# EAGLE design PCB-CMB-2b (EAGLE 6.4)

## Sheet 1 of 2
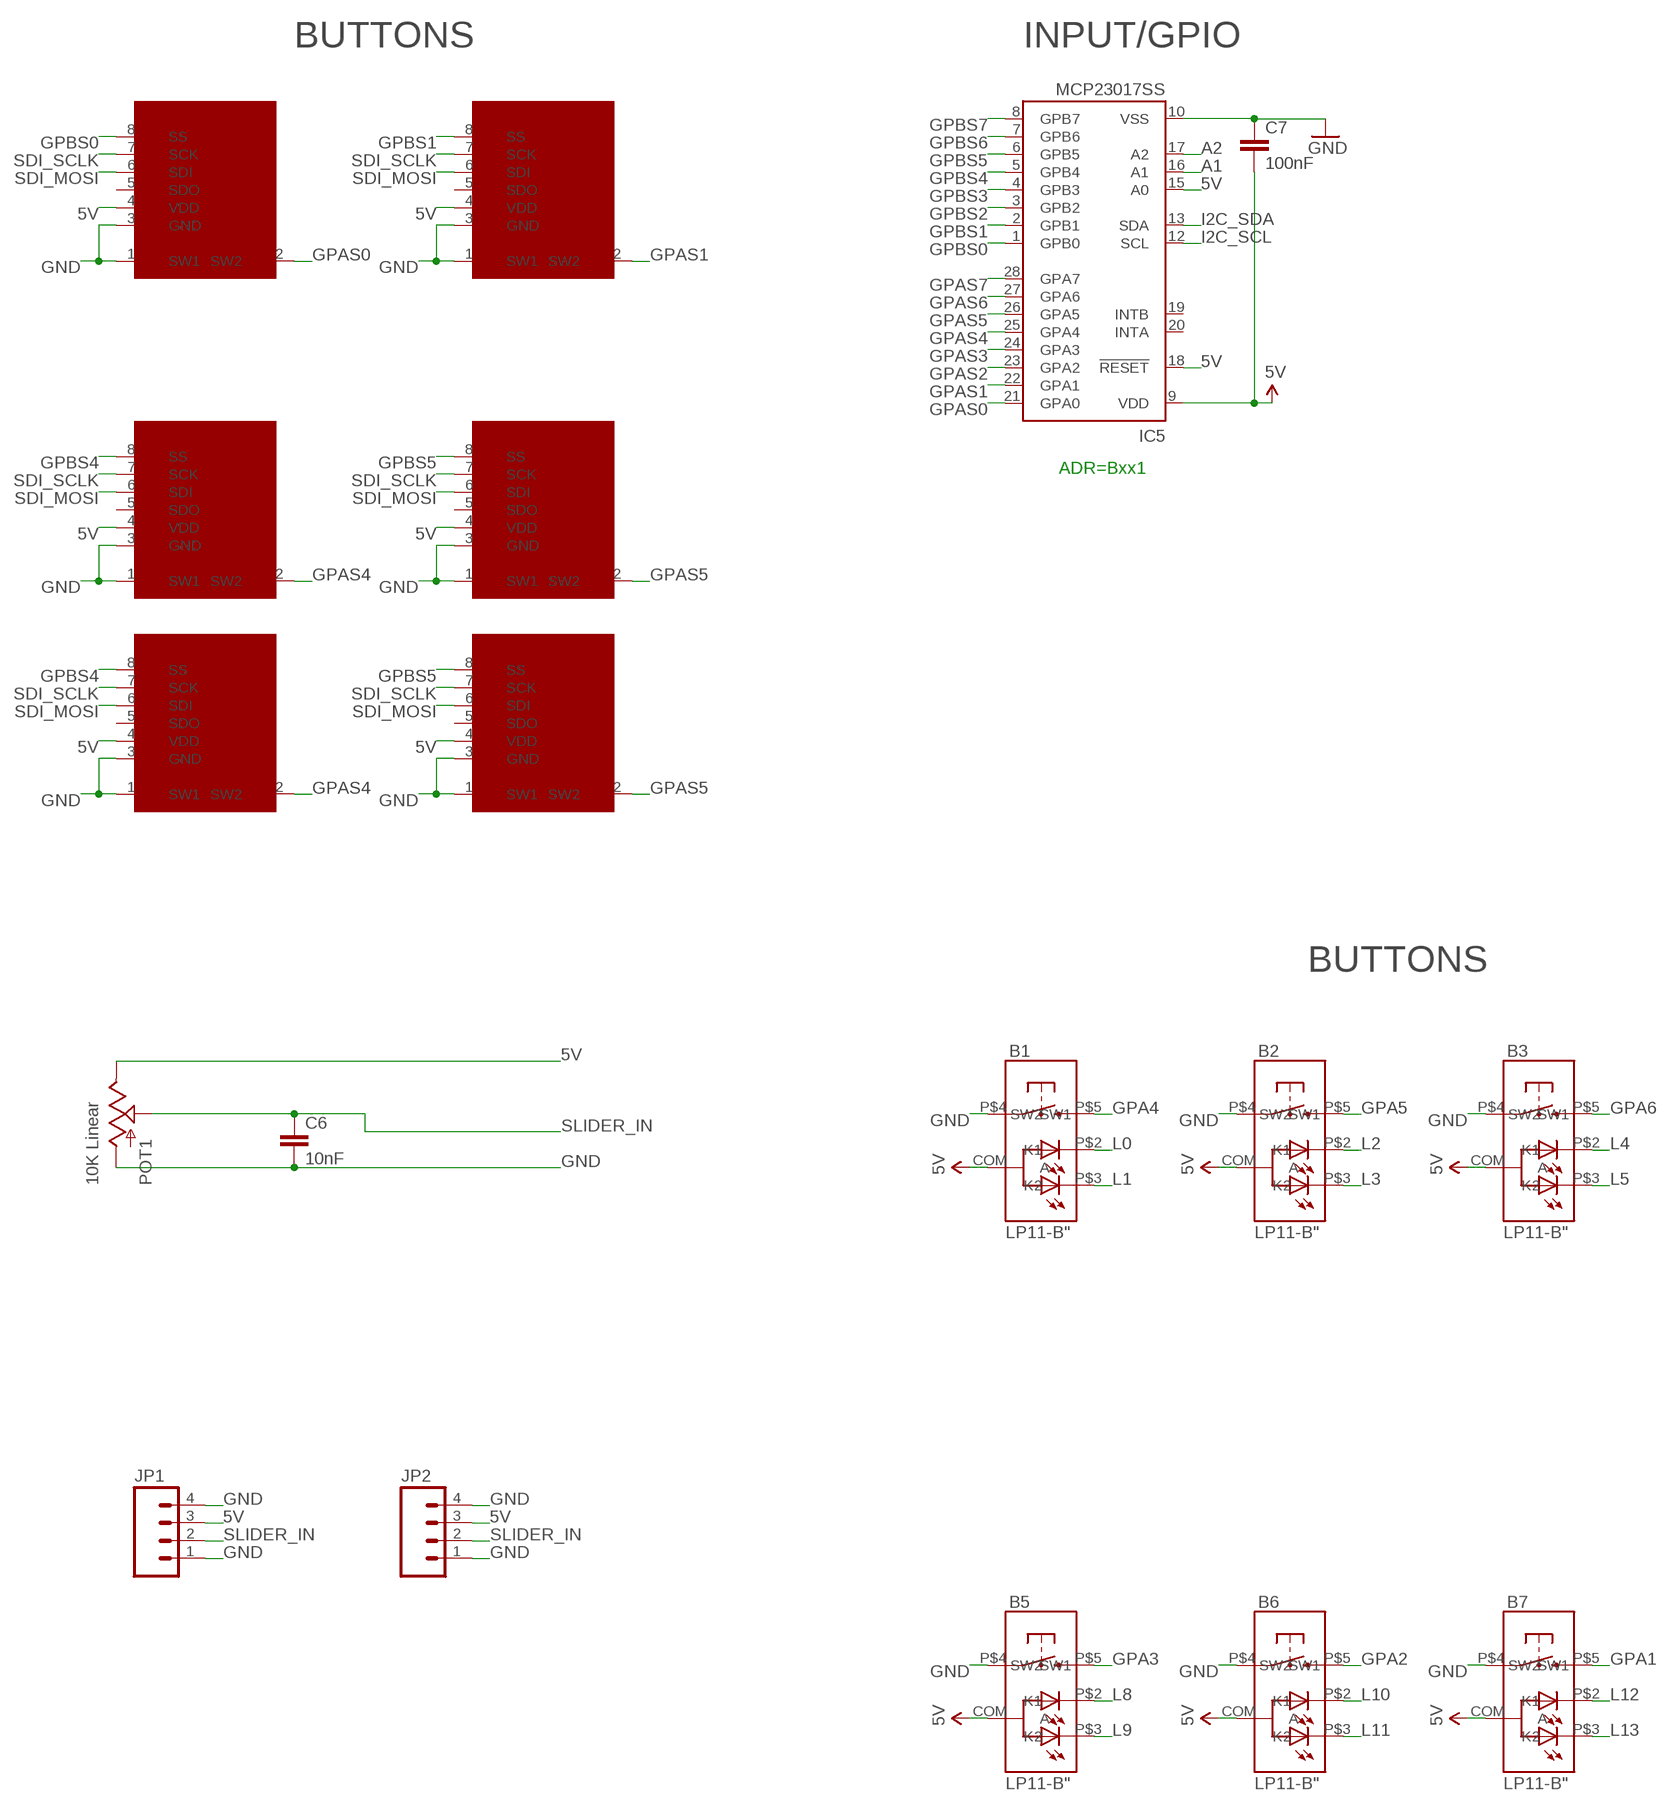
[diagram p0: schematic, sheet 1, part 1 of 2]
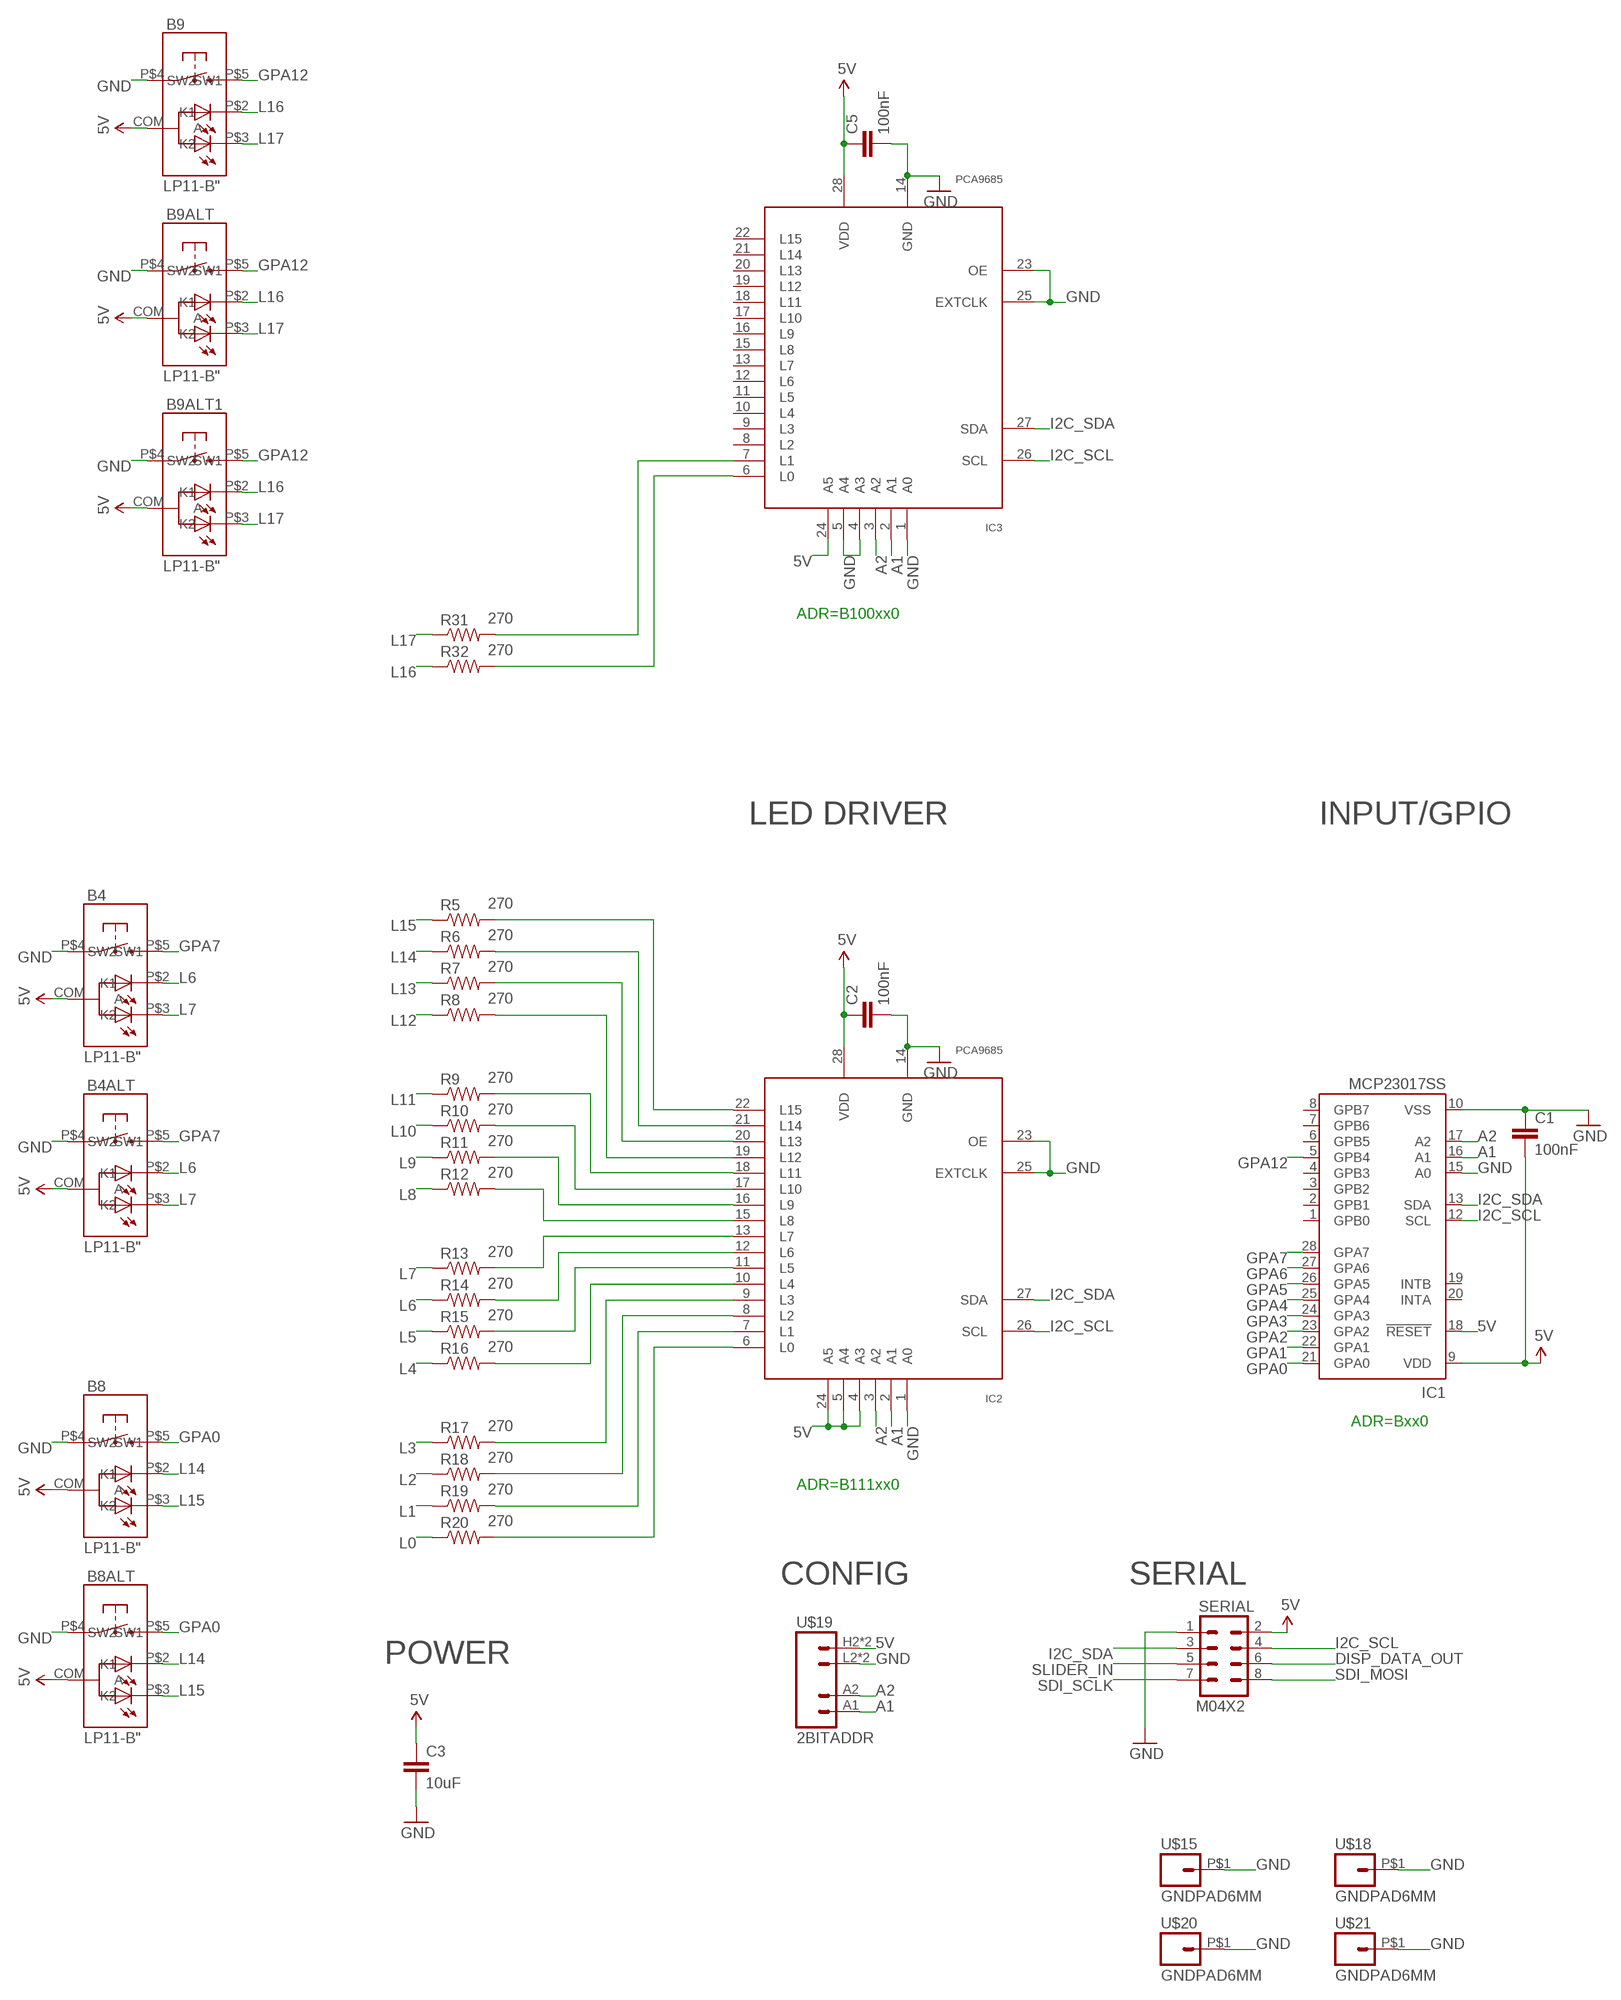
[diagram p1: schematic, sheet 1, part 2 of 2]

### Parts
B1  LP11-B"  [LP11]
B2  LP11-B"  [LP11]
B3  LP11-B"  [LP11]
B4  LP11-B"  [LP11]
B4ALT  LP11-B"  [LP11]
B5  LP11-B"  [LP11]
B6  LP11-B"  [LP11]
B7  LP11-B"  [LP11]
B8  LP11-B"  [LP11]
B8ALT  LP11-B"  [LP11]
B9  LP11-B"  [LP11]
B9ALT  LP11-B"  [LP11]
B9ALT1  LP11-B"  [LP11]
C1  100nF  CAP0603-CAP  [0603-CAP]
C2  100nF  CAP0603-CAP  [0603-CAP]
C3  10uF  CAP0805  [0805]
C5  100nF  CAP0603-CAP  [0603-CAP]
C6  10nF  CAP0603-CAP  [0603-CAP]
C7  100nF  CAP0603-CAP  [0603-CAP]
IC1  MCP23017SS  [SSOP28]
IC2  PCA9685  [TSSOP28]
IC3  PCA9685  [TSSOP28]
IC5  MCP23017SS  [SSOP28]
JP1  M04PTH  [1X04]
JP2  M04PTH  [1X04]
POT1  10K Linear  SLIDER20  [SLIDER20]
R5  270  RESISTOR0603-RES  [0603-RES]
R6  270  RESISTOR0603-RES  [0603-RES]
R7  270  RESISTOR0603-RES  [0603-RES]
R8  270  RESISTOR0603-RES  [0603-RES]
R9  270  RESISTOR0603-RES  [0603-RES]
R10  270  RESISTOR0603-RES  [0603-RES]
R11  270  RESISTOR0603-RES  [0603-RES]
R12  270  RESISTOR0603-RES  [0603-RES]
R13  270  RESISTOR0603-RES  [0603-RES]
R14  270  RESISTOR0603-RES  [0603-RES]
R15  270  RESISTOR0603-RES  [0603-RES]
R16  270  RESISTOR0603-RES  [0603-RES]
R17  270  RESISTOR0603-RES  [0603-RES]
R18  270  RESISTOR0603-RES  [0603-RES]
R19  270  RESISTOR0603-RES  [0603-RES]
R20  270  RESISTOR0603-RES  [0603-RES]
R31  270  RESISTOR0603-RES  [0603-RES]
R32  270  RESISTOR0603-RES  [0603-RES]
SERIAL  M04X2  [2X4]
SSW1  SMART_SWITCHSMART_SWITCH_8PIN  [SMART_SWITCH]
SSW2  SMART_SWITCHSMART_SWITCH_8PIN  [SMART_SWITCH]
SSW5  SMART_SWITCHSMART_SWITCH_8PIN  [SMART_SWITCH]
SSW5ALT  SMART_SWITCHSMART_SWITCH_8PIN  [SMART_SWITCH]
SSW6  SMART_SWITCHSMART_SWITCH_8PIN  [SMART_SWITCH]
SSW6ALT  SMART_SWITCHSMART_SWITCH_8PIN  [SMART_SWITCH]
U$15  GNDPAD6MM  [3.2MMPAD6MM]
U$18  GNDPAD6MM  [3.2MMPAD6MM]
U$19  2BITADDR  [2BITADDR]
U$20  GNDPAD6MM  [3.2MMPAD6MM]
U$21  GNDPAD6MM  [3.2MMPAD6MM]

### Nets
5V [Power]: B1.COM(A) B2.COM(A) B3.COM(A) B4.COM(A) B4ALT.COM(A) B5.COM(A) B6.COM(A) B7.COM(A) B8.COM(A) B8ALT.COM(A) B9.COM(A) B9ALT1.COM(A) B9ALT.COM(A) C1.2 C2.1 C3.1 C5.1 C7.2 IC1.9(VDD) IC1.18(!RESET) IC2.4(A3) IC2.5(A4) IC2.24(A5) IC2.28(VDD) IC3.24(A5) IC3.28(VDD) IC5.9(VDD) IC5.15(A0) IC5.18(!RESET) JP1.3 JP2.3 POT1.1(E) SERIAL.2 SSW1.4(VDD) SSW2.4(VDD) SSW5.4(VDD) SSW5ALT.4(VDD) SSW6.4(VDD) SSW6ALT.4(VDD) U$19.H2(VCC) U$19.H3(VCC)
A1: IC1.16(A1) IC2.2(A1) IC3.2(A1) IC5.16(A1) U$19.A1
A2: IC1.17(A2) IC2.3(A2) IC3.3(A2) IC5.17(A2) U$19.A2
DISP_DATA_OUT: SERIAL.6
GND [Power]: B1.P$4(SW1) B2.P$4(SW1) B3.P$4(SW1) B4.P$4(SW1) B4ALT.P$4(SW1) B5.P$4(SW1) B6.P$4(SW1) B7.P$4(SW1) B8.P$4(SW1) B8ALT.P$4(SW1) B9.P$4(SW1) B9ALT1.P$4(SW1) B9ALT.P$4(SW1) C1.1 C2.2 C3.2 C5.2 C6.2 C7.1 IC1.10(VSS) IC1.15(A0) IC2.1(A0) IC2.14(GND) IC2.23(OE) IC2.25(EXTCLK) IC3.1(A0) IC3.4(A3) IC3.5(A4) IC3.14(GND) IC3.23(OE) IC3.25(EXTCLK) IC5.10(VSS) JP1.1 JP1.4 JP2.1 JP2.4 POT1.3(A) SERIAL.1 SSW1.1(SW1) SSW1.3(GND) SSW2.1(SW1) SSW2.3(GND) SSW5.1(SW1) SSW5.3(GND) SSW5ALT.1(SW1) SSW5ALT.3(GND) SSW6.1(SW1) SSW6.3(GND) SSW6ALT.1(SW1) SSW6ALT.3(GND) U$15.P$1 U$18.P$1 U$19.L2(GND) U$19.L3(GND) U$20.P$1 U$21.P$1
GPA0: B8.P$5(SW2) B8ALT.P$5(SW2) IC1.21(GPA0)
GPA1: B7.P$5(SW2) IC1.22(GPA1)
GPA2: B6.P$5(SW2) IC1.23(GPA2)
GPA3: B5.P$5(SW2) IC1.24(GPA3)
GPA4: B1.P$5(SW2) IC1.25(GPA4)
GPA5: B2.P$5(SW2) IC1.26(GPA5)
GPA6: B3.P$5(SW2) IC1.27(GPA6)
GPA7: B4.P$5(SW2) B4ALT.P$5(SW2) IC1.28(GPA7)
GPA12: B9.P$5(SW2) B9ALT1.P$5(SW2) B9ALT.P$5(SW2) IC1.5(GPB4)
GPAS0: IC5.21(GPA0) SSW1.2(SW2)
GPAS1: IC5.22(GPA1) SSW2.2(SW2)
GPAS2: IC5.23(GPA2)
GPAS3: IC5.24(GPA3)
GPAS4: IC5.25(GPA4) SSW5.2(SW2) SSW5ALT.2(SW2)
GPAS5: IC5.26(GPA5) SSW6.2(SW2) SSW6ALT.2(SW2)
GPAS6: IC5.27(GPA6)
GPAS7: IC5.28(GPA7)
GPBS0: IC5.1(GPB0) SSW1.8(SS)
GPBS1: IC5.2(GPB1) SSW2.8(SS)
GPBS2: IC5.3(GPB2)
GPBS3: IC5.4(GPB3)
GPBS4: IC5.5(GPB4) SSW5.8(SS) SSW5ALT.8(SS)
GPBS5: IC5.6(GPB5) SSW6.8(SS) SSW6ALT.8(SS)
GPBS6: IC5.7(GPB6)
GPBS7: IC5.8(GPB7)
I2C_SCL: IC1.12(SCL) IC2.26(SCL) IC3.26(SCL) IC5.12(SCL) SERIAL.4
I2C_SDA: IC1.13(SDA) IC2.27(SDA) IC3.27(SDA) IC5.13(SDA) SERIAL.3
L0: B1.P$2(K1) R20.1
L1: B1.P$3(K2) R19.1
L2: B2.P$2(K1) R18.1
L3: B2.P$3(K2) R17.1
L4: B3.P$2(K1) R16.1
L5: B3.P$3(K2) R15.1
L6: B4.P$2(K1) B4ALT.P$2(K1) R14.1
L7: B4.P$3(K2) B4ALT.P$3(K2) R13.1
L8: B5.P$2(K1) R12.1
L9: B5.P$3(K2) R11.1
L10: B6.P$2(K1) R10.1
L11: B6.P$3(K2) R9.1
L12: B7.P$2(K1) R8.1
L13: B7.P$3(K2) R7.1
L14: B8.P$2(K1) B8ALT.P$2(K1) R6.1
L15: B8.P$3(K2) B8ALT.P$3(K2) R5.1
L16: B9.P$2(K1) B9ALT1.P$2(K1) B9ALT.P$2(K1) R32.1
L17: B9.P$3(K2) B9ALT1.P$3(K2) B9ALT.P$3(K2) R31.1
N$4: IC2.13(L7) R13.2
N$5: IC2.12(L6) R14.2
N$7: IC2.11(L5) R15.2
N$9: IC2.10(L4) R16.2
N$10: IC2.9(L3) R17.2
N$11: IC2.8(L2) R18.2
N$12: IC2.7(L1) R19.2
N$14: IC3.7(L1) R31.2
N$15: IC3.6(L0) R32.2
N$19: IC2.6(L0) R20.2
N$20: IC2.15(L8) R12.2
N$21: IC2.16(L9) R11.2
N$22: IC2.17(L10) R10.2
N$23: IC2.18(L11) R9.2
N$24: IC2.19(L12) R8.2
N$25: IC2.20(L13) R7.2
N$26: IC2.21(L14) R6.2
N$27: IC2.22(L15) R5.2
SDI_MOSI: SERIAL.8 SSW1.6(SDI) SSW2.6(SDI) SSW5.6(SDI) SSW5ALT.6(SDI) SSW6.6(SDI) SSW6ALT.6(SDI)
SDI_SCLK: SERIAL.7 SSW1.7(SCK) SSW2.7(SCK) SSW5.7(SCK) SSW5ALT.7(SCK) SSW6.7(SCK) SSW6ALT.7(SCK)
SLIDER_IN: C6.1 JP1.2 JP2.2 POT1.2A(S) SERIAL.5
Unconnected: IC1.1(GPB0) IC1.2(GPB1) IC1.3(GPB2) IC1.4(GPB3) IC1.6(GPB5) IC1.7(GPB6) IC1.8(GPB7) IC1.19(INTB) IC1.20(INTA) IC3.8(L2) IC3.9(L3) IC3.10(L4) IC3.11(L5) IC3.12(L6) IC3.13(L7) IC3.15(L8) IC3.16(L9) IC3.17(L10) IC3.18(L11) IC3.19(L12) IC3.20(L13) IC3.21(L14) IC3.22(L15) IC5.19(INTB) IC5.20(INTA) SSW1.5(SDO) SSW2.5(SDO) SSW5.5(SDO) SSW5ALT.5(SDO) SSW6.5(SDO) SSW6ALT.5(SDO)

### Notes on the sheet
- BUTTONS | INPUT/GPIO
- ADR=Bxx1
- ADR=B100xx0
- BUTTONS | LED DRIVER | INPUT/GPIO
- ADR=Bxx0
- ADR=B111xx0
- CONFIG | SERIAL
- POWER

## Sheet 2 of 2

## Library data of the parts
B1-B4 B4ALT B5-B8 B8ALT B9 B9ALT B9ALT1 = SKAARHOJ:LP11-B
C1-C3 C5-C7 = SparkFun:CAP: Capacitor Standard 0603 ceramic capacitor, and 0.1" leaded capacitor.
IC1 IC5 = microchip:MCP23017: http://ww1.microchip.com/downloads/en/DeviceDoc/21952a.pdf Source: http://ww1.microchip.com/downloads/en/DeviceDoc/21952a.pdf; MF: MICROCHIP; MPN: MCP23017-E/SS; OC_FARNELL: 1467674; OC_NEWARK: 31K2960
IC2 IC3 = wsmith:PCA9685
JP1 JP2 = SparkFun:M04: Header 4 Standard 4-pin 0.1" header. Use with straight break away headers (SKU : PRT-00116), right angle break away headers (PRT-00553), swiss pins (PRT-00743), machine pins (PRT-00117), and female headers (PRT-00115). Molex polarized connector foot print use with SKU : PRT-08231 with associated crimp pins and housings. 1MM SMD Version SKU: PRT-10208
POT1 = SKAARHOJ:SLIDER
R5-R20 R31 R32 = SparkFun:RESISTOR: Resistor Basic schematic elements and footprints for 0603, 1206, and PTH resistors.
SERIAL = SparkFun:M04X2
SSW1 SSW2 SSW5 SSW5ALT SSW6 SSW6ALT = SKAARHOJ:SMART_SWITCH: SMARTSWITCH IS15DSBFP4RGB www.nkksmartswitch.com
U$15 U$18 U$20 U$21 = SKAARHOJ:GNDPAD
U$19 = SKAARHOJ:2BITADDR

## Net classes
0 default: width 0.203 mm, drill 0.406 mm, clearance 0.203 mm
1 Power: width 0.406 mm, drill 0.61 mm, clearance 0.203 mm

## Board
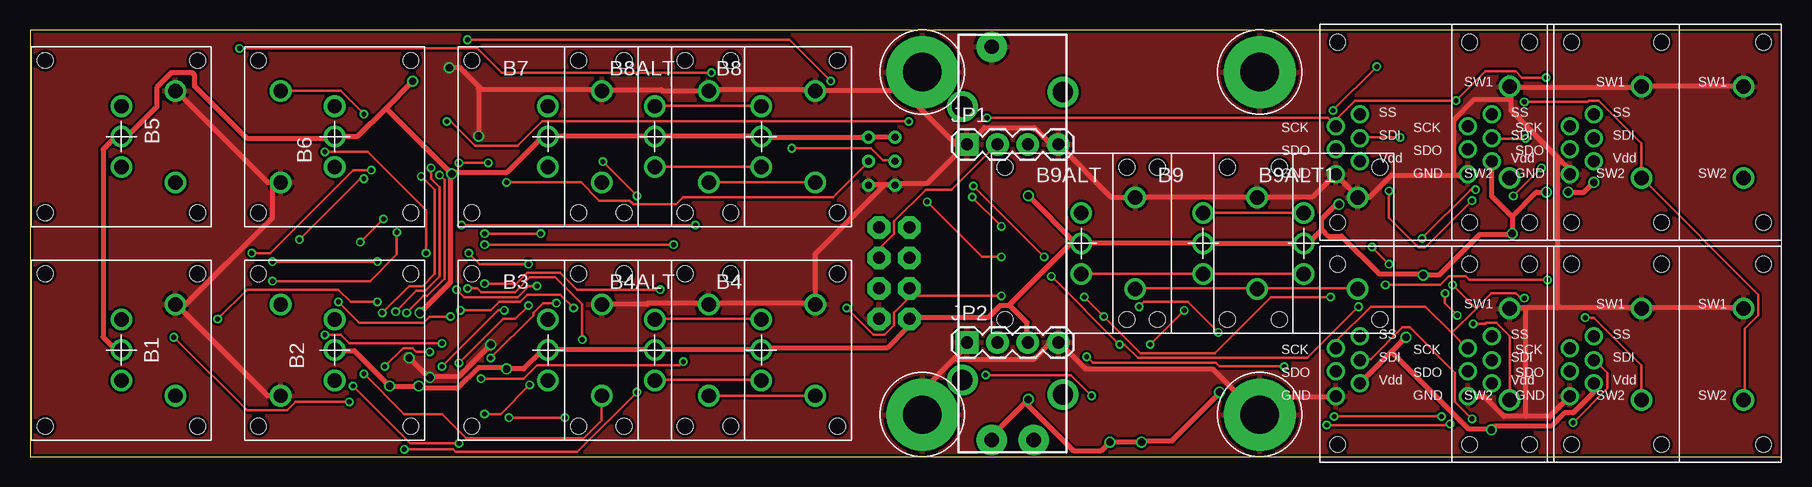
[diagram p2: board, top side]
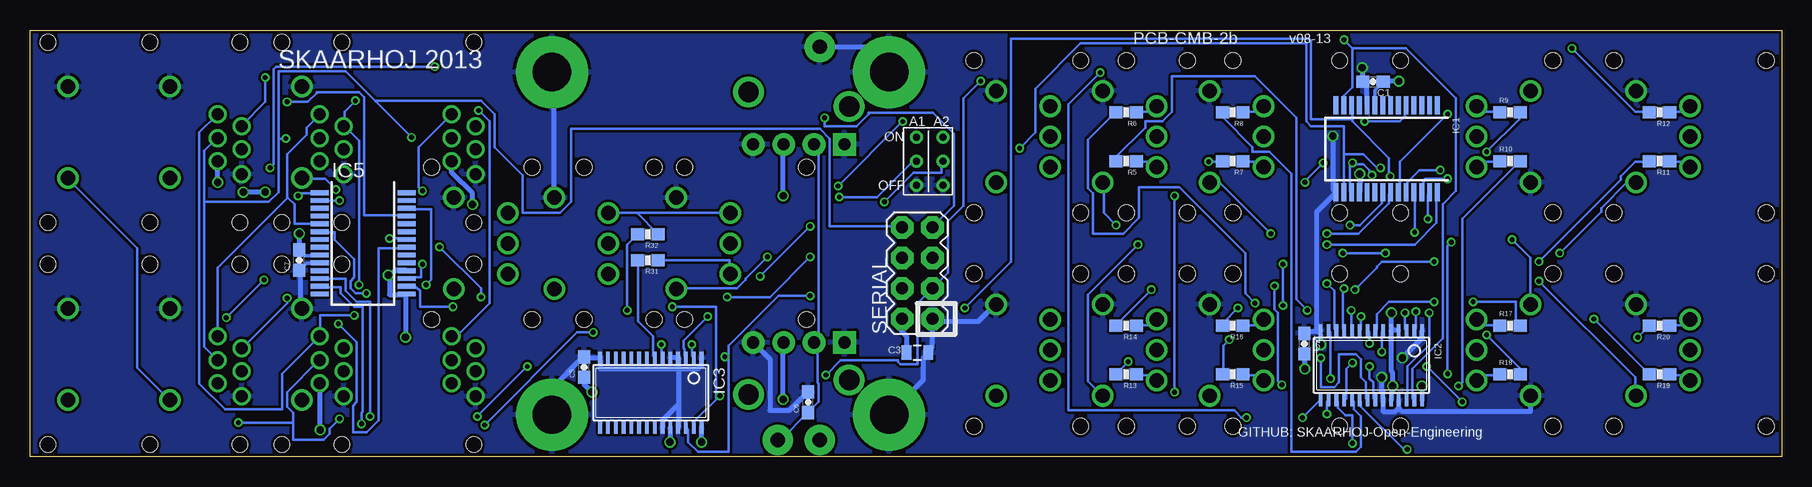
[diagram p3: board, bottom side, seen from below]

Size 146 x 35.56 mm. Coordinates in mm from the lower left corner, seen from the top.
Outline: 0,0 146,0 146,35.56 0,35.56 0,0
Copper layers (1*16): Top 0.035mm / dielectric 1.5mm / Bottom 0.035mm
Design rules "Fusion_eagle_rule_v1.1": minimum track width 6mil, minimum drill 12mil, track to track 6mil, track to pad 6mil, pad to pad 6mil, via to via 6mil, smd to smd 0mil, copper to edge 10mil, drill to drill 10mil, minimum pad ring 10mil, minimum via ring 6mil, stop-mask expansion 2mil, vias tented up to drill 100mil, thermal gap 10mil

### Footprints (pad centres in the part's own frame; a part is rotated, then mirrored left to right if it is on the bottom)
LP11 = drill 1.2: COM 0,0; P$2 0,2.54; P$3 0,-2.54; P$4 4.5,3.81; P$5 4.5,-3.81 | hole 1.3: -6.35,6.35; 6.35,6.35; 6.35,-6.35; -6.35,-6.35
0603-CAP = smd 1.1 x 1: 1 -0.85,0; 2 0.85,0
0805 = smd 0.8 x 1.2: 1 -0.9,0; 2 0.9,0
SSOP28 = smd 0.4 x 1.5: 1 -4.225,-3.625; 2 -3.575,-3.625; 3 -2.925,-3.625; 4 -2.275,-3.625; 5 -1.625,-3.625; 6 -0.975,-3.625; 7 -0.325,-3.625; 8 0.325,-3.625; 9 0.975,-3.625; 10 1.625,-3.625; 11 2.275,-3.625; 12 2.925,-3.625; 13 3.575,-3.625; 14 4.225,-3.625; 15 4.225,3.625; 16 3.575,3.625; 17 2.925,3.625; 18 2.275,3.625; 19 1.625,3.625; 20 0.975,3.625; 21 0.325,3.625; 22 -0.325,3.625; 23 -0.975,3.625; 24 -1.625,3.625; 25 -2.275,3.625; 26 -2.925,3.625; 27 -3.575,3.625; 28 -4.225,3.625
TSSOP28 = smd 0.305 x 0.991: 1 -4.225,-2.918; 2 -3.575,-2.918; 3 -2.925,-2.918; 4 -2.275,-2.918; 5 -1.625,-2.918; 6 -0.975,-2.918; 7 -0.325,-2.918; 8 0.325,-2.918; 9 0.975,-2.918; 10 1.625,-2.918; 11 2.275,-2.918; 12 2.925,-2.918; 13 3.575,-2.918; 14 4.225,-2.918; 15 4.225,2.918; 16 3.575,2.918; 17 2.925,2.918; 18 2.275,2.918; 19 1.625,2.918; 20 0.975,2.918; 21 0.325,2.918; 22 -0.325,2.918; 23 -0.975,2.918; 24 -1.625,2.918; 25 -2.275,2.918; 26 -2.925,2.918; 27 -3.575,2.918; 28 -4.225,2.918
1X04 = drill 1.016 pad 1.88 square: 1 0,0 | drill 1.016 pad 1.88: 2 2.54,0; 3 5.08,0; 4 7.62,0
SLIDER20 = drill 1.194 pad 2.54: 1 -16.383,1.74; 2A -16.383,-1.74; 3 16.383,1.74 | drill 1.702: P$1 -11.392,4.191; P$2 11.392,4.191; P$3 12.598,-4.191; P$4 -12.598,-4.191
0603-RES = smd 1.1 x 1: 1 -0.85,0; 2 0.85,0
2X4 = drill 1.016 pad 1.88 octagon: 1 -3.81,-1.27; 2 -3.81,1.27; 3 -1.27,-1.27; 4 -1.27,1.27; 5 1.27,-1.27; 6 1.27,1.27; 7 3.81,-1.27; 8 3.81,1.27
SMART_SWITCH = drill 1.2: 1 6.35,3.81; 2 6.35,-3.81 | drill 1: 3 -8.153,-3.48; 4 -6.147,-2.413; 5 -8.153,-1.422; 6 -6.147,-0.483; 7 -8.153,0.508; 8 -6.147,1.499 | hole 1.3: -8.001,7.506; 8.001,7.506; 8.001,-7.506; -8.001,-7.506
3.2MMPAD6MM = drill 3.2 pad 6: P$1 0,0
2BITADDR = drill 0.6: A1 0,0; A2 2.2,0; H2 0,2; H3 2.2,2; L2 0,-2; L3 2.2,-2

### Placement (x,y rotation side)
B1  7.62,8.89 0 top
B2  25.4,8.89 180 top
B3  43.18,8.89 0 top
B4  60.96,8.89 0 top
B4ALT  52.07,8.89 0 top
B5  7.62,26.67 0 top
B6  25.4,26.67 180 top
B7  43.18,26.67 0 top
B8  60.96,26.67 0 top
B8ALT  52.07,26.67 0 top
B9  97.79,17.78 0 top
B9ALT  87.63,17.78 0 top
B9ALT1  106.17,17.78 0 top
C1  34.05,31.24 0 bottom
C2  39.77,9.42 90 bottom
C3  72.04,8.67 0 bottom
C5  99.81,7.47 90 bottom
C6  81.13,4.54 90 bottom
C7  123.57,16.38 90 bottom
IC1  32.91,25.65 180 bottom
IC2  34.18,7.62 180 bottom
IC3  94.25,5.33 180 bottom
IC5  118.24,17.78 270 bottom
JP1  78.11,26.04 0 top
JP2  78.11,9.53 0 top
POT1  81.92,17.78 90 top
R5  54.63,24.64 180 bottom
R6  54.63,28.7 180 bottom
R7  45.74,24.64 180 bottom
R8  45.74,28.7 180 bottom
R9  22.62,28.7 0 bottom
R10  22.62,24.64 0 bottom
R11  10.18,24.64 180 bottom
R12  10.18,28.7 180 bottom
R13  54.63,6.86 180 bottom
R14  54.63,10.92 180 bottom
R15  45.74,6.86 180 bottom
R16  45.74,10.92 180 bottom
R17  22.62,10.92 0 bottom
R18  22.62,6.86 0 bottom
R19  10.18,6.86 180 bottom
R20  10.18,10.92 180 bottom
R31  94.5,16.38 180 bottom
R32  94.5,18.54 180 bottom
SERIAL  72.04,15.3 90 bottom
SSW1  117,8.53 0 top
SSW2  117,27.03 0 top
SSW5  136.5,8.53 0 top
SSW5ALT  128,27.03 0 top
SSW6  136.5,27.03 0 top
SSW6ALT  128,8.53 0 top
U$15  74.39,3.5 0 top
U$18  102.5,3.5 0 top
U$19  72.1,24.62 0 bottom
U$20  74.39,32.06 0 top
U$21  102.5,32.06 0 top

### Tracks (layer width: path | path; a pad name or v marks a point on that pad's centre or on a via)
5V  (via drill 0.61)
  Top 0.406: B1.COM 7.62,8.94 7.11,8.94 6.1,9.96 6.1,25.6 7.11,26.62 7.62,26.62 B5.COM 7.72,26.82 8.23,26.82 10.57,29.16 10.57,30.79 11.79,32 13.51,32 13.72,31.8 13.72,30.89 18.09,26.52 25.3,26.52 B6.COM 25.4,26.72 27.33,26.72 29.67,29.06 | 29.67,29.06 v31.9,31.29 | 29.67,29.06 v35.15,23.57 | U$19.H2 72.03,26.62 70,26.62 U$19.H3 69.8,26.62 60.96,26.62 B8.COM 60.86,26.72 52.22,26.72 B8ALT.COM 52.02,26.72 43.18,26.72 B7.COM 43.08,26.52 42.57,26.52 39.73,23.67 35.26,23.67 v35.15,23.57 | SSW5.4 130.35,6.1 130.35,5.38 128.63,3.66 127.91,3.66 126.8,2.54 122.12,2.54 v121.82,2.23 121.72,2.34 119.89,2.34 113.49,8.74 | 123.55,20.02 v123.55,18.59 123.44,18.49 120.8,18.49 117.45,15.14 v116.13,15.14 116.03,15.24 112.47,15.24 109.32,18.39 108.2,18.39 107.7,18.9 | 123.55,20.02 121.82,21.74 121.82,24.59 SSW5ALT.4 | v114.71,9.96 113.49,8.74 | 113.49,8.74 110.95,6.2 SSW1.4 | v130.35,22.86 129.54,22.05 v128.22,22.05 | v126.39,22.05 125.58,22.05 123.55,20.02 | B2.COM 25.4,8.84 27.03,8.84 v29.97,5.89 v32.41,5.89 32.51,5.79 32.82,5.79 32.92,5.69 35.66,5.69 37.39,7.42 39.62,7.42 v39.73,7.32 41.15,7.32 42.67,8.84 43.18,8.84 B3.COM 43.28,8.94 52.02,8.94 B4ALT.COM 52.22,8.94 60.96,8.94 B4.COM 61.06,9.04 71.42,9.04 73.15,10.77 73.15,11.38 SERIAL.2 73.36,11.58 79.86,11.58 80.87,12.6 81.69,12.6 | v109.12,21.03 108.92,21.03 107.7,19.81 107.7,18.9 | 107.7,18.9 106.58,17.78 B9ALT1.COM B9.COM B9ALT.COM | v83.21,21.74 87.07,17.88 87.48,17.88 B9ALT.COM | v99.16,5.38 99.16,5.28 95.2,1.32 92.76,1.32 v92.66,1.22 v90.02,1.22 89.31,0.51 86.97,0.51 83.01,4.47 v83.21,4.78 80.26,1.83 80.26,1.42 POT1.1
  Top 0.406: 81.69,12.6 83.11,11.18 83.11,9.55 JP2.3 | B9ALT.COM 86.87,17.88 81.69,12.7 81.69,12.6 | v32.51,11.99 35.05,14.53 35.05,23.47 v35.15,23.57
  Bottom 0.305: C7.2 123.53,17.23 123.06,16.76 121.9,16.76 IC5.9 | IC1.9 33.88,30.56 C1.2
  Bottom 0.406: v31.9,31.29 33.12,31.29 C1.2 | v35.15,23.57 35.15,22.05 IC1.18 | v121.82,2.23 121.82,6.1 SSW6ALT.4 | 114.71,13.51 116.03,13.51 116.03,15.04 | 116.03,15.04 115.52,15.54 114.71,15.54 IC5.18 | 114.71,13.51 IC5.15 | v123.55,18.59 123.55,17.37 C7.2 | v116.13,15.14 116.03,15.04 | 114.71,13.51 v114.71,9.96 | v130.35,22.86 130.35,24.59 SSW6.4 | v126.39,22.05 v128.22,22.05 | IC2.4 32,10.57 32.51,10.57 IC2.5 | v29.97,5.89 29.97,4.78 IC2.28 | IC2.24 32.51,4.78 32.51,5.38 32.41,5.49 v32.41,5.89 32.41,7.01 32.51,7.11 32.51,10.36 IC2.5 | v39.73,7.32 39.73,8.53 C2.1 | v109.12,21.03 109.12,21.95 110.85,23.67 110.85,24.59 SSW2.4 | v83.21,21.74 83.21,26.01 JP1.3 | v90.02,1.22 90.02,2.34 IC3.28 | v92.66,1.22 92.66,2.34 IC3.24 | v99.16,5.38 99.77,5.99 99.77,6.6 C5.1 | C3.1 72.95,8.74 72.95,10.06 73.36,10.46 73.36,11.48 SERIAL.2 | v83.21,4.78 83.21,9.45 JP2.3 | v32.51,11.99 32.51,10.77 IC2.5
A1  (via drill 0.41)
  Top 0.203: v110.74,12.5 106.48,8.23 92.35,8.23 91.24,9.35 v90.83,9.35 v85.14,15.04 | v30.48,12.09 32.21,13.82 32.92,13.82 34.14,15.04 34.14,22.45 33.43,23.16 v33.43,24.08 | v63.5,25.7 70.1,25.7 71.12,24.69 72.03,24.69 U$19.A1 | v78.54,21.64 v80.97,19.2
  Bottom 0.203: v90.83,9.35 90.83,8.43 90.73,8.33 IC3.2 | v110.74,12.5 113.49,12.5 113.49,13.82 113.79,14.12 114.61,14.12 IC5.16 | v30.48,12.09 30.48,10.67 30.58,10.57 IC2.2 | v33.43,24.08 33.73,24.08 34.85,25.2 36.47,25.2 | 36.47,25.2 36.47,22.05 IC1.16 | v63.5,25.7 62.18,27.03 62.18,30.68 58.42,34.44 39.62,34.44 39.62,27.94 39.22,27.53 36.47,27.53 36.47,25.2 | v80.97,19.2 v85.14,15.04 | v78.54,21.64 75.39,21.64 72.44,24.59 72.14,24.59 U$19.A1
A2  (via drill 0.41)
  Top 0.203: v31.39,11.99 32.82,13.41 33.12,13.41 34.54,14.83 34.54,23.06 v34.14,23.47 | v87.88,13.31 v89.51,11.68 92.56,8.64 98.75,8.64 103.43,13.31 v108.41,13.31 | v80.97,16.66 79.35,16.66 v74.78,21.23 | v111.86,17.48 v113.28,16.05 | v38.2,24.49 v35.76,24.49 | v39.73,22.86 45.92,22.86 47.45,21.34 49.99,21.34 50.29,21.03 53.85,21.03 54.46,21.64 66.95,21.64 69.9,24.59 U$19.A2
  Bottom 0.203: v31.39,11.99 31.39,10.67 31.29,10.57 IC2.3 | v34.14,23.47 34.34,23.67 34.34,23.88 34.85,24.38 35.76,24.38 | 35.76,24.38 35.97,24.38 35.97,22.15 35.87,22.05 IC1.17 | v89.51,11.68 91.54,9.65 91.54,9.04 91.44,8.94 91.44,8.43 91.34,8.33 IC3.3 | v87.88,13.31 84.33,13.31 v80.97,16.66 | v74.78,21.23 72.34,23.67 70,23.67 70,24.59 U$19.A2 | v113.28,16.05 113.39,15.95 113.39,14.94 114.61,14.94 IC5.17 | v111.86,17.48 108.41,14.02 v108.41,13.31 | v35.76,24.49 35.76,24.38 | v38.2,24.49 39.73,22.96 v39.73,22.86
GND  (via drill 0.61)
  Top 0.406: 124.66,3.35 126.69,3.35 128.32,4.98 SSW5.3 | 124.66,3.35 122.83,3.35 121.21,4.98 119.89,4.98 SSW6ALT.3 | SSW5.1 142.85,12.39 134.42,12.39 SSW6ALT.1 134.21,12.39 127.31,12.39 | 127.31,12.39 124.66,12.39 | 124.66,12.39 123.44,12.39 SSW1.1 | 124.66,12.39 124.66,3.35 | SSW6.1 142.85,30.89 134.42,30.89 SSW5ALT.1 134.21,30.79 123.65,30.79 SSW2.1 123.44,30.79 123.44,29.77 | 127.41,24.89 123.44,28.85 123.44,29.77 | 127.41,24.89 128.32,23.98 128.32,23.57 SSW6.3 | 118.67,23.47 113.49,23.47 111.66,21.64 110.95,21.64 B9ALT1.P$4 110.74,21.64 108.92,23.47 SSW2.3 108.71,23.47 106.88,21.64 102.31,21.64 B9.P$4 102.11,21.64 92.25,21.64 B9ALT.P$4 92.05,21.64 90.12,21.64 JP1.4 85.55,26.11 85.04,26.11 83.72,27.43 79.55,27.43 78.23,26.11 JP1.1 | 118.67,23.47 119.79,23.47 SSW5ALT.3 | 123.44,29.77 120.4,29.77 118.67,28.04 118.67,23.47 | 127.31,12.39 127.31,24.79 127.41,24.89 | SSW1.3 108.81,4.98 103.94,4.98 102.51,3.56 U$18.P$1 102.31,3.56 98.55,7.32 87.99,7.32 85.85,9.45 JP2.4 85.65,9.45 85.04,9.45 83.72,8.13 77.22,8.13 77.11,8.23 | B3.P$4 51.41,12.7 51.51,12.8 56.39,12.8 56.49,12.7 B4ALT.P$4 56.69,12.8 65.33,12.8 65.43,12.7 B4.P$4 65.43,12.9 65.43,16.87 71.12,22.55 71.12,22.66 | 77.11,8.23 74.47,5.59 74.47,3.56 U$15.P$1 | 77.11,8.23 78.03,9.14 78.03,9.45 JP2.1 | B5.P$4 12.19,30.48 19.81,22.86 B6.P$4 20.22,22.76 20.22,19.91 12.7,12.39 B1.P$4 12.19,12.7 19.81,5.08 B2.P$4 | v31.6,8.23 33.22,6.6 v33.33,6.6 33.43,6.71 35.76,6.71 v38.41,9.35 | v34.95,32.41 35.87,32.41 37.49,30.79 | 37.49,30.79 37.69,30.58 47.55,30.58 47.65,30.48 B7.P$4 47.85,30.58 52.63,30.58 52.73,30.48 B8ALT.P$4 56.69,30.58 65.33,30.58 B8.P$4 72.85,30.48 74.37,32 U$20.P$1 72.85,30.38 77.52,25.7 JP1.1
  Top 0.406: 71.12,22.66 72.03,22.66 U$19.L2 72.24,22.76 74.78,22.76 78.03,26.01 JP1.1 | 71.12,22.66 70,22.66 U$19.L3 | v37.39,26.72 37.39,30.68 37.49,30.79
  Bottom 0.305: C7.1 123.53,15.53 122.94,16.13 121.89,16.13 IC5.10
  Bottom 0.406: C7.1 123.44,15.44 123.44,12.39 SSW1.1 | U$21.P$1 102.41,32 102.31,31.9 102.31,21.64 B9.P$4 | 91.95,7.32 90.32,7.32 90.02,7.62 90.02,8.23 IC3.1 | 91.95,7.32 91.95,8.23 IC3.4 92.15,8.23 92.56,8.23 IC3.5 | 91.95,7.32 91.95,4.27 | 91.95,4.27 91.95,2.44 IC3.25 | IC3.23 93.27,2.44 93.27,3.05 92.05,4.27 91.95,4.27 | 98.45,8.23 IC3.14 | IC3.14 98.65,8.23 99.77,8.23 C5.2 99.97,8.23 102.41,5.79 102.41,3.56 U$18.P$1 | 91.95,7.32 98.45,7.32 98.45,8.03 IC3.14 | B4.P$4 65.53,12.7 66.95,11.28 70.61,11.28 70.61,11.38 SERIAL.1 70.81,11.48 70.81,9.04 71.12,8.74 C3.2 71.22,8.53 71.53,8.23 71.53,6.4 74.37,3.56 U$15.P$1 | JP2.4 84.33,8.13 84.33,3.86 82.7,3.86 81.18,5.38 C6.2 | 38.71,10.46 39.73,10.46 39.73,10.36 C2.2 | 38.71,10.46 38.51,10.46 IC2.14 38.51,10.26 38.41,10.16 v38.41,9.35 | 38.71,10.46 38.71,20.42 37.19,21.95 IC1.15 37.29,22.15 37.39,22.25 v37.39,26.72 | 31.9,4.06 31.9,4.67 IC2.25 | 31.9,4.06 32.21,3.76 33.22,3.76 33.22,4.67 IC2.23 33.22,4.88 33.22,5.38 33.33,5.49 v33.33,6.6 | v31.6,8.23 29.97,9.86 29.97,10.46 IC2.1 | 31.9,4.06 31.6,3.76 20.93,3.76 20.93,5.08 B2.P$4 | IC1.10 34.54,29.36 34.54,30.89 34.85,31.19 C1.1 34.95,31.39 v34.95,32.41 | POT1.3 80.16,34.14 74.47,34.14 74.47,32.11 U$20.P$1
  pour Top: 0,0 146.05,0 146.05,35.56 0,35.56
  pour Bottom: 0,0 146.05,0 146.05,35.56 0,35.56
GPA0  (via drill 0.41)
  Top 0.203: v55.47,19.3 v35.97,19.3 | B8ALT.P$5 B8.P$5
  Bottom 0.203: v35.97,19.3 35.15,19.3 33.33,21.13 33.33,21.95 IC1.21 | v55.47,19.3 56.49,20.32 56.49,22.86 B8ALT.P$5
GPA1  (via drill 0.41)
  Top 0.203: v42.57,18.59 v37.9,18.59
  Bottom 0.203: v37.9,18.59 35.26,18.59 32.72,21.13 32.72,21.84 32.61,21.95 IC1.22 | v42.57,18.59 46.84,22.86 B7.P$5
GPA2  (via drill 0.41)
  Top 0.203: v27.84,28.55 25.91,30.48 B6.P$5
  Bottom 0.203: v27.84,28.55 31.8,24.59 31.8,22.15 31.9,22.05 IC1.23
GPA3  (via drill 0.41)
  Top 0.203: v28.45,23.88 26.92,23.88 20.02,16.97 v18.49,16.97
  Bottom 0.203: v28.45,23.88 30.18,23.88 31.19,22.86 31.19,22.05 IC1.24 | v18.49,16.97 15.04,20.42 15.04,20.73 12.9,22.86 B5.P$5
GPA4  (via drill 0.41)
  Top 0.203: v30.58,18.69 30.58,16.87 28.35,14.63 v20.22,14.63
  Bottom 0.203: v30.58,18.69 30.58,21.95 IC1.25 | v20.22,14.63 12.19,6.6 12.19,5.08 B1.P$5
GPA5  (via drill 0.41)
  Top 0.203: v27.84,23.16 27.53,23.16 v22.45,18.09
  Bottom 0.203: v27.84,23.16 29.67,23.16 29.87,22.96 29.87,22.15 29.97,22.05 IC1.26 | v22.45,18.09 20.93,16.56 20.93,12.7 B2.P$5
GPA6  (via drill 0.41)
  Top 0.203: v27.53,17.88 v29.46,19.81 | v27.84,6.91 31.19,3.56 34.34,3.56 36.37,1.52 46.13,1.52 47.65,3.05 47.65,5.08 B3.P$5
  Bottom 0.203: v29.46,19.81 29.46,21.84 29.36,21.95 IC1.27 | v27.53,17.88 27.84,17.58 v27.84,6.91
GPA7  (via drill 0.41)
  Top 0.203: v53.65,17.68 v37.9,17.68 | B4ALT.P$5 B4.P$5
  Bottom 0.203: v37.9,17.68 30.58,17.68 28.75,19.51 28.75,21.95 IC1.28 | v53.65,17.68 57.81,13.51 57.81,6.3 56.59,5.08 B4ALT.P$5
GPA12  (via drill 0.41)
  Top 0.203: B9ALT1.P$5 110.64,14.02 102.31,14.02 B9.P$5 102.21,14.02 92.15,14.02 B9ALT.P$5 | v34.75,27.94 35.05,27.94 37.08,25.91 40.64,25.91 42.67,27.94 v73.25,27.94 | v84.53,16.66 v78.64,22.55
  Bottom 0.203: v34.75,27.94 31.8,27.94 31.39,28.35 31.39,29.16 31.29,29.26 IC1.5 | v78.64,22.55 v73.25,27.94 | v84.53,16.66 86.36,14.83 86.36,14.73 87.07,14.02 92.05,14.02 B9ALT.P$5
GPAS0  (via drill 0.41)
  Top 0.203: v120.29,11.07 121.31,11.07 121.41,11.18 122.22,11.18 123.34,10.06 123.34,4.78 SSW1.2
  Bottom 0.203: v120.29,11.07 118.77,9.55 118.77,4.57 119.08,4.27 119.08,2.03 117.96,2.03 116.94,3.05 116.94,17.37 114.71,17.37 IC5.21
GPAS1  (via drill 0.41)
  Top 0.203: v116.03,18.19 120.09,22.25 v120.5,22.25
  Bottom 0.203: v116.03,18.19 114.71,18.19 IC5.22 | v120.5,22.25 121.41,23.16 123.34,23.16 SSW2.2
GPAS4  (via drill 0.41)
  Top 0.203: v124.56,29.57 129.84,29.57 129.95,29.67 130.76,29.67 134.31,26.11 134.31,23.27 SSW5ALT.2 134.42,23.16 144.07,13.51 144.07,11.79 142.95,10.67 142.95,4.78 SSW5.2
  Bottom 0.203: v124.56,29.57 122.83,29.57 122.12,30.28 122.12,30.38 118.57,30.38 118.16,29.97 118.16,20.12 114.71,20.12 IC5.25
GPAS5  (via drill 0.41)
  Top 0.203: v112.98,14.33 117.55,14.33 118.26,15.04 119.69,15.04 119.99,14.73 v126.49,14.73 | v129.64,11.58 130.35,11.58 134.31,7.62 134.31,4.78 SSW6ALT.2
  Bottom 0.203: v112.98,14.33 112.57,14.73 112.57,20.62 114.61,20.62 IC5.26 | v129.64,11.58 v126.49,14.73 | SSW6.2 142.85,23.16 137.06,17.37 137.06,7.42 134.42,4.78 SSW6ALT.2
GPBS0  (via drill 0.41)
  Top 0.203: v125.98,24.08 v123.65,21.74 | v108.61,28.85 v112.27,32.51
  Bottom 0.203: v123.65,21.74 123.65,21.95 121.92,21.95 IC5.1 | v125.98,24.08 125.68,24.38 125.68,32.31 125.48,32.51 v112.27,32.51 | v108.61,28.85 107.7,27.94 107.7,12.8 110.44,10.06 110.85,10.06 SSW1.8
GPBS1  (via drill 0.41)
  Top 0.203: v120.19,21.34 116.33,17.48 115.72,17.48 113.28,19.91 v113.28,22.15
  Bottom 0.203: v120.19,21.34 121.82,21.34 IC5.2 | v113.28,22.15 113.59,22.45 113.59,25.81 110.95,28.45 SSW2.8
GPBS4
  Bottom 0.203: 124.51,21.59 124.56,21.64 124.56,25.2 122.94,26.82 122.94,27.43 121.92,28.45 SSW5ALT.8 | 124.51,21.59 123.95,21.03 123.95,19.41 121.92,19.41 IC5.5 | 124.51,21.59 130.35,15.75 130.35,10.06 SSW5.8
GPBS5  (via drill 0.41)
  Top 0.203: v117.96,13.61 117.96,12.8 v118.97,11.79
  Bottom 0.203: v117.96,13.61 118.87,13.61 119.28,14.02 119.28,14.63 118.97,14.94 118.97,16.46 120.6,18.09 120.6,18.69 121.82,18.69 IC5.6 | v118.97,11.79 121.82,11.79 121.82,10.06 SSW6ALT.8 121.92,9.96 124.97,6.91 124.97,3.96 129.74,3.96 131.88,6.1 131.88,27.03 130.45,28.45 SSW6.8
I2C_SCL  (via drill 0.41)
  Top 0.203: v29.36,11.99 31.6,14.22 32.72,14.22 33.73,15.24 33.73,22.25 v32.61,23.37 | v80.97,13.41 73.97,13.41 73.36,14.02 SERIAL.4 73.66,13.61 72.03,11.99 72.03,10.97 71.22,10.16 70.31,10.16 v68.07,12.39 | v108.71,3.35 v117.65,3.35 | v104.55,7.52 99.16,7.52 98.86,7.82 88.59,7.82 v88.09,8.33
  Bottom 0.203: v29.36,11.99 29.36,9.35 31.19,7.52 31.19,4.78 IC2.26 | v32.61,23.37 32.72,23.47 32.72,24.89 35.76,27.94 35.76,28.14 | 35.76,28.14 35.76,29.26 IC1.12 | 87.78,8.33 87.78,9.25 83.62,13.41 v80.97,13.41 | 87.78,8.33 87.78,0.41 90.32,0.41 91.14,1.22 91.14,2.23 91.24,2.34 IC3.26 | v117.65,3.35 117.65,12.9 118.77,12.9 119.69,13.82 119.69,14.83 121.82,14.83 IC5.12 | v104.55,7.52 v108.71,3.35 | 87.78,8.33 v88.09,8.33 | 35.76,28.14 39.22,28.14 39.22,34.65 39.42,34.85 64.21,34.85 64.21,16.26 v68.07,12.39
I2C_SDA  (via drill 0.41)
  Top 0.203: v88.49,5.08 86.77,6.81 v79.65,6.81 | v118.36,2.74 118.06,2.74 117.96,2.64 v108.1,2.64 | v99.06,10.36 96.52,12.9 92.86,12.9 v92.46,12.5 | v36.47,34.75 63.3,34.75 v66.75,31.29
  Bottom 0.203: 35.76,34.04 31.29,34.04 27.13,29.87 27.13,22.15 28.25,21.03 28.25,9.86 30.79,7.32 30.79,4.88 30.68,4.78 IC2.27 | 35.76,34.04 35.76,30.79 36.47,30.07 36.47,29.36 IC1.13 | v88.49,5.08 88.75,4.83 | 88.75,4.83 90.63,2.95 90.63,2.44 IC3.27 | v79.65,6.81 78.44,8.03 73.66,8.03 73.66,7.92 73.46,7.72 72.03,7.72 72.03,12.8 70.81,14.02 SERIAL.3 70.71,14.12 69.49,15.34 69.49,19.61 68.17,20.93 68.17,29.87 v66.75,31.29 | v118.36,2.74 118.36,3.66 118.26,3.76 118.26,12.5 118.97,12.5 120.09,13.61 120.09,14.12 121.82,14.12 IC5.13 | v108.1,2.64 100.38,10.36 v99.06,10.36 | v92.46,12.5 88.8,12.5 88.8,4.88 88.75,4.83 | v36.47,34.75 35.76,34.04
L0
  Bottom 0.203: B1.P$2 7.62,10.97 9.25,10.97 R20.1
L1
  Bottom 0.203: B1.P$3 7.62,6.81 9.25,6.81 R19.1
L2
  Bottom 0.203: B2.P$2 25.4,6.81 23.57,6.81 R18.1
L3
  Bottom 0.203: B2.P$3 25.4,10.97 23.57,10.97 R17.1
L4
  Bottom 0.203: B3.P$2 43.18,10.97 44.81,10.97 R16.1
L5
  Bottom 0.203: B3.P$3 43.18,6.81 44.81,6.81 R15.1
L6
  Top 0.203: B4ALT.P$2 52.12,11.48 60.96,11.48 B4.P$2
  Bottom 0.203: R14.1 53.75,10.97 52.12,10.97 52.12,11.38 B4ALT.P$2
L7
  Top 0.203: B4ALT.P$3 52.12,6.4 60.96,6.4 B4.P$3
  Bottom 0.203: R13.1 53.75,6.81 52.12,6.81 52.12,6.4 B4ALT.P$3
L8
  Bottom 0.203: B5.P$2 7.62,28.75 9.25,28.75 R12.1
L9
  Bottom 0.203: B5.P$3 7.62,24.59 9.25,24.59 R11.1
L10
  Bottom 0.203: B6.P$2 25.4,24.59 23.57,24.59 R10.1
L11
  Bottom 0.203: B6.P$3 25.4,28.75 23.57,28.75 R9.1
L12
  Bottom 0.203: B7.P$2 43.18,28.75 44.81,28.75 R8.1
L13
  Bottom 0.203: B7.P$3 43.18,24.59 44.81,24.59 R7.1
L14
  Top 0.203: B8ALT.P$2 52.12,29.26 60.96,29.26 B8.P$2
  Bottom 0.203: R6.1 53.75,28.75 52.12,28.75 52.12,29.16 B8ALT.P$2
L15
  Top 0.203: B8ALT.P$3 52.12,24.18 60.96,24.18 B8.P$3
  Bottom 0.203: R5.1 53.75,24.59 52.12,24.59 52.12,24.18 B8ALT.P$3
L16
  Top 0.203: B9.P$2 B9ALT1.P$2
  Bottom 0.203: 95.35,20.27 95.4,20.32 B9.P$2 | 95.35,20.27 93.67,18.59 R32.1 | B9ALT.P$2 95.3,20.32 95.35,20.27
L17
  Top 0.203: B9ALT1.P$3 B9.P$3 B9ALT.P$3
  Bottom 0.203: R31.1 93.57,16.36 87.68,16.36 87.68,15.24 B9ALT.P$3
N$4  (via drill 0.41)
  Top 0.203: v37.59,6.5 41.15,6.5 42.27,7.62 54.15,7.62 v54.46,7.92
  Bottom 0.203: v37.59,6.5 37.59,10.36 37.69,10.46 IC2.13 | v54.46,7.92 55.47,6.91 R13.2
N$5  (via drill 0.41)
  Top 0.203: v37.9,14.43 40.54,14.43 41.45,15.34 44.2,15.34 45.62,13.92 v52.53,13.92
  Bottom 0.203: v37.9,14.43 37.29,13.82 37.29,10.67 37.19,10.57 IC2.12 | v52.53,13.92 55.47,10.97 R14.2
N$7  (via drill 0.41)
  Top 0.203: v36.47,14.02 37.29,14.02 37.59,13.72 40.44,13.72 41.66,14.94 43.79,14.94 46.02,12.7 v46.02,9.75
  Bottom 0.203: v36.47,14.02 36.58,13.92 36.58,10.67 36.47,10.57 IC2.11 | v46.02,9.75 46.53,9.25 46.53,6.91 R15.2
N$9  (via drill 0.41)
  Top 0.203: v35.87,12.19 38.41,12.19 39.12,12.9 40.84,12.9 41.45,13.51 44.2,13.51 v45.31,12.39
  Bottom 0.203: v35.87,12.19 35.87,10.57 IC2.10 | v45.31,12.39 46.53,11.18 46.53,10.97 R16.2
N$10  (via drill 0.41)
  Top 0.203: v35.05,11.68 33.33,11.68 32.82,11.18 27.43,11.18 v25.7,12.9
  Bottom 0.203: v35.05,11.68 35.05,10.67 35.15,10.57 IC2.9 | v25.7,12.9 22.15,12.9 22.15,11.28 21.84,10.97 R17.2
N$11  (via drill 0.41)
  Top 0.203: v34.34,9.45 26.62,9.45 25.91,10.16 v24.59,10.16
  Bottom 0.203: v34.34,9.45 34.34,10.36 34.44,10.46 IC2.8 | v24.59,10.16 21.84,7.42 21.84,6.91 R18.2
N$12  (via drill 0.41)
  Top 0.203: v28.96,12.9 26.72,12.9 25.7,13.92 18.09,13.92 v15.65,11.48
  Bottom 0.203: v28.96,12.9 32.72,12.9 33.73,11.89 33.73,10.67 33.83,10.57 IC2.7 | v15.65,11.48 11.07,6.91 R19.2
N$14
  Bottom 0.203: IC3.7 93.98,8.33 94.08,8.43 94.08,10.06 95.3,11.28 95.3,16.36 R31.2
N$15  (via drill 0.41)
  Top 0.203: v96.22,12.19 v93.37,9.35
  Bottom 0.203: v93.37,9.35 93.37,8.33 IC3.6 | v96.22,12.19 96.22,17.68 95.4,18.49 R32.2
N$19  (via drill 0.41)
  Top 0.203: v33.33,8.74 32.21,8.74 31.9,9.04 31.09,9.04 v29.57,7.52 | v26.62,4.57 22.15,4.57 21.44,3.86 18.09,3.86 v11.99,9.96
  Bottom 0.203: v33.33,8.74 33.33,10.36 33.22,10.46 IC2.6 | v26.62,4.57 v29.57,7.52 | v11.99,9.96 11.07,10.87 R20.2
N$20  (via drill 0.41)
  Top 0.203: v44.6,3.25 v39.93,3.25 | v56.79,32 39.32,32 37.29,34.04 v17.48,34.04
  Bottom 0.203: v39.93,3.25 38.51,4.67 IC2.15 | v44.6,3.25 45.01,3.25 45.62,3.86 59.44,3.86 59.44,29.36 v56.79,32 | v17.48,34.04 12.19,28.75 11.07,28.75 R12.2
N$21  (via drill 0.41)
  Top 0.203: v37.9,3.56 39.22,3.56 v41.66,5.99 | v42.27,14.22 41.55,14.22 40.64,13.31 36.17,13.31 v35.56,13.92 | v20.22,16.26 v28.96,16.26
  Bottom 0.203: v37.9,3.56 37.9,4.57 37.8,4.67 IC2.16 | v41.66,5.99 41.96,6.3 41.96,11.99 42.27,12.29 v42.27,14.22 | v35.56,13.92 33.73,15.75 33.73,15.85 33.33,16.26 v28.96,16.26 | v20.22,16.26 13.41,23.06 13.41,23.37 12.19,24.59 11.07,24.59 R11.2
N$22  (via drill 0.41)
  Top 0.203: v35.76,1.12 31.7,1.12 v26.92,5.89
  Bottom 0.203: v35.76,1.12 35.76,3.45 36.37,3.45 36.98,4.06 36.98,4.57 37.08,4.67 IC2.17 | v26.92,5.89 26.62,6.2 26.62,19.81 21.84,24.59 R10.2
N$23  (via drill 0.41)
  Top 0.203: v35.76,7.82 39.42,11.48 40.44,11.48 v41.55,12.6 | v41.55,16.05 37.49,16.05 v36.58,16.97 | v33.02,16.97 33.02,20.52 28.14,25.4 v24.59,25.4
  Bottom 0.203: v35.76,7.82 36.27,7.32 36.27,4.88 36.37,4.78 IC2.18 | v41.55,16.05 v41.55,12.6 | v33.02,16.97 v36.58,16.97 | v24.59,25.4 21.84,28.14 21.84,28.65 R9.2
N$24
  Bottom 0.203: IC2.19 35.76,4.67 35.66,4.57 35.66,3.96 35.05,3.35 35.05,0.81 35.46,0.41 40.84,0.41 40.84,23.57 42.67,25.4 44.09,25.4 44.09,25.81 46.53,28.25 46.53,28.65 R8.2
N$25  (via drill 0.41)
  Top 0.203: v31.19,0.61 35.26,0.61 35.46,0.41 45.62,0.41 v50.6,5.38 | v47.75,24.59 v50.6,21.74
  Bottom 0.203: v31.19,0.61 31.5,0.61 35.05,4.17 35.05,4.57 35.15,4.67 IC2.20 | v50.6,21.74 v50.6,5.38 | v47.75,24.59 46.63,24.59 R7.2
N$26  (via drill 0.41)
  Top 0.203: v38.41,8.23 41.96,11.79 41.96,11.99 42.77,12.8 v43.89,12.8
  Bottom 0.203: v38.41,8.23 38.41,5.79 37.29,5.79 36.88,6.2 36.88,8.53 35.46,8.53 35.05,8.13 35.05,6.6 34.65,6.2 34.65,4.88 34.54,4.78 IC2.21 | v43.89,12.8 44.7,13.61 44.7,16.97 50.19,22.45 53.54,22.45 53.54,19.91 54.86,18.59 57.4,18.59 57.4,21.95 57.81,22.35 57.81,26.42 55.58,28.65 R6.2
N$27  (via drill 0.41)
  Top 0.203: v34.34,7.52 39.01,12.19 v39.52,12.19
  Bottom 0.203: v34.34,7.52 34.34,6.5 34.04,6.2 34.04,4.88 33.93,4.78 IC2.22 | v39.52,12.19 40.44,13.11 40.44,28.25 43.89,31.7 50.8,31.7 50.8,28.75 51.61,27.94 53.03,27.94 53.03,27.43 55.47,24.99 55.47,24.69 R5.2
SDI_MOSI  (via drill 0.41)
  Top 0.203: v120.19,3.15 118.77,4.57 118.77,7.01 115.01,10.77 114.4,10.77 111.76,8.13 110.95,8.13 SSW1.6 | v114.2,26.62 110.95,26.62 SSW2.6 | v124.66,26.52 121.92,26.52 SSW5ALT.6 | v128.63,2.85 131.47,5.69 131.47,7.01 130.45,8.03 SSW5.6
  Bottom 0.203: v120.19,3.15 121.01,2.34 121.01,1.93 121.51,1.42 124.05,1.42 124.05,2.85 | 124.05,2.85 124.05,3.66 124.56,4.17 124.56,5.38 121.92,8.03 SSW6ALT.6 | 117.2,29.62 119.69,32.11 125.27,32.11 125.27,26.52 | 117.2,29.62 v114.2,26.62 | 125.27,26.52 125.27,22.05 126.09,21.23 131.47,21.23 | 131.47,21.23 131.47,25.5 130.45,26.52 SSW6.6 | 125.27,26.52 v124.66,26.52 | 131.47,21.23 131.47,9.14 130.45,8.13 SSW5.6 | SERIAL.8 73.36,19.2 79.35,19.2 79.35,26.52 80.16,27.33 100.89,27.33 100.89,21.23 101.8,20.32 104.95,20.32 104.95,23.47 107.29,25.81 107.29,28.55 108.41,29.67 117.14,29.67 117.2,29.62 | v128.63,2.85 124.05,2.85
SDI_SCLK  (via drill 0.41)
  Top 0.203: 118.52,10.31 119.79,9.04 SSW6ALT.7 | 118.52,10.31 116.33,12.5 111.76,12.5 108.92,9.65 108.92,9.04 SSW1.7 | v124.56,13.21 124.26,13.21 123.85,13.61 121.82,13.61 120.55,12.34 | 118.52,10.31 120.55,12.34 | v126.39,31.6 124.36,31.6 123.85,32.11 121.31,32.11 v118.87,29.67 110.44,29.67 108.92,28.14 108.92,27.64 SSW2.7 108.81,27.64 108.2,28.25 v79.76,28.25 | v118.57,14.33 120.55,12.34
  Bottom 0.203: v124.56,13.21 124.56,12.8 128.32,9.04 SSW5.7 | v118.87,29.67 119.79,28.75 119.79,27.64 SSW5ALT.7 119.79,27.53 118.57,26.31 v118.57,14.33 | v126.39,31.6 126.39,29.57 128.32,27.64 SSW6.7 | v79.76,28.25 79.76,27.53 77.11,27.53 76.1,28.55 76.1,28.65 70.71,28.65 68.99,26.92 68.99,20.93 70.71,19.2 SERIAL.7
SLIDER_IN
  Top 0.203: SERIAL.5 70.81,16.66 70.81,17.37 72.03,18.59 72.03,19.61 74.68,22.25 76.81,22.25 80.57,26.01 JP1.2
  Bottom 0.203: POT1.2A 83.62,1.42 83.41,1.42 81.18,3.66 C6.1 81.08,3.76 80.26,4.57 80.26,6.1 80.37,6.2 80.37,9.25 JP2.2 80.57,9.55 80.26,9.86 80.26,25.7 80.57,26.01 JP1.2

### Text on the board
_bsilk: v08-13 | PCB-CMB-2b | SKAARHOJ 2013 | GITHUB: SKAARHOJ-Open-Engineering